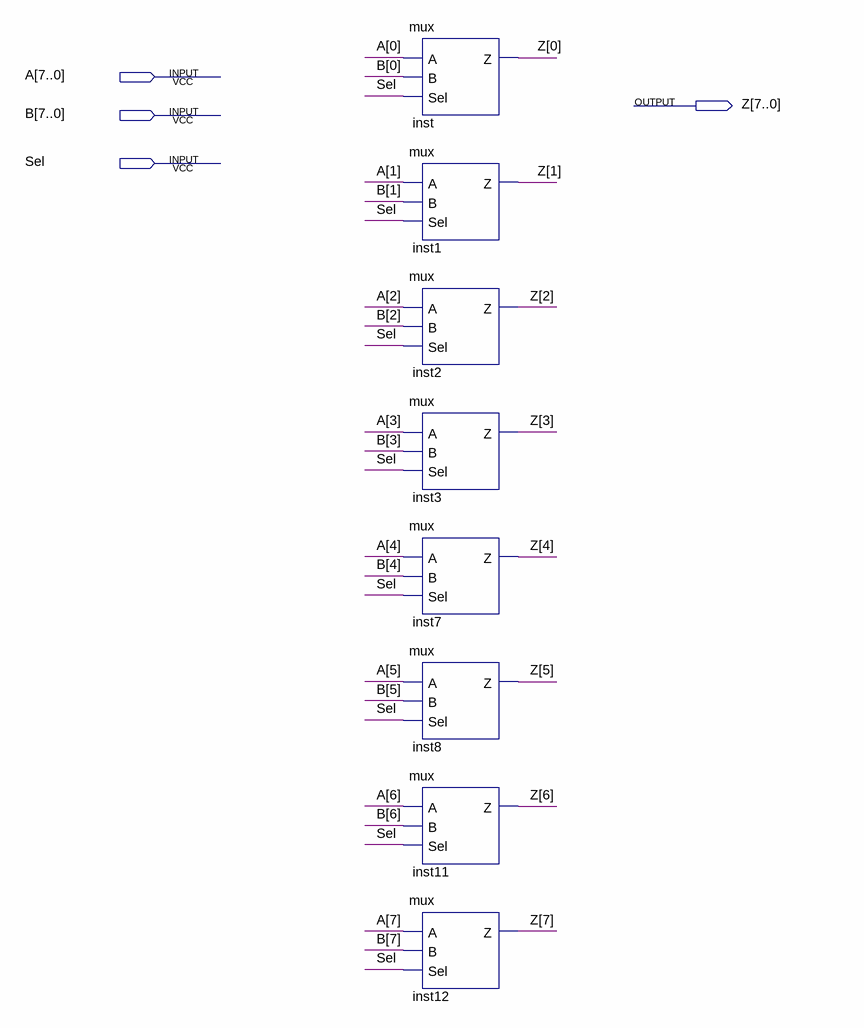
[diagram p0: schematic sheet]
// Quartus schematic mux8.bdf as structural Verilog: 8 symbols, 4 pins
module mux8 (
  input  [7:0] A,
  input  [7:0] B,
  input  Sel,
  output [7:0] Z
);

  mux inst (.A(A[0]), .B(B[0]), .Sel(Sel), .Z(Z[0]));
  mux inst1 (.A(A[1]), .B(B[1]), .Sel(Sel), .Z(Z[1]));
  mux inst2 (.A(A[2]), .B(B[2]), .Sel(Sel), .Z(Z[2]));
  mux inst3 (.A(A[3]), .B(B[3]), .Sel(Sel), .Z(Z[3]));
  mux inst7 (.A(A[4]), .B(B[4]), .Sel(Sel), .Z(Z[4]));
  mux inst8 (.A(A[5]), .B(B[5]), .Sel(Sel), .Z(Z[5]));
  mux inst11 (.A(A[6]), .B(B[6]), .Sel(Sel), .Z(Z[6]));
  mux inst12 (.A(A[7]), .B(B[7]), .Sel(Sel), .Z(Z[7]));
endmodule
